# EAGLE design FanControllerv10 (EAGLE 6.4)
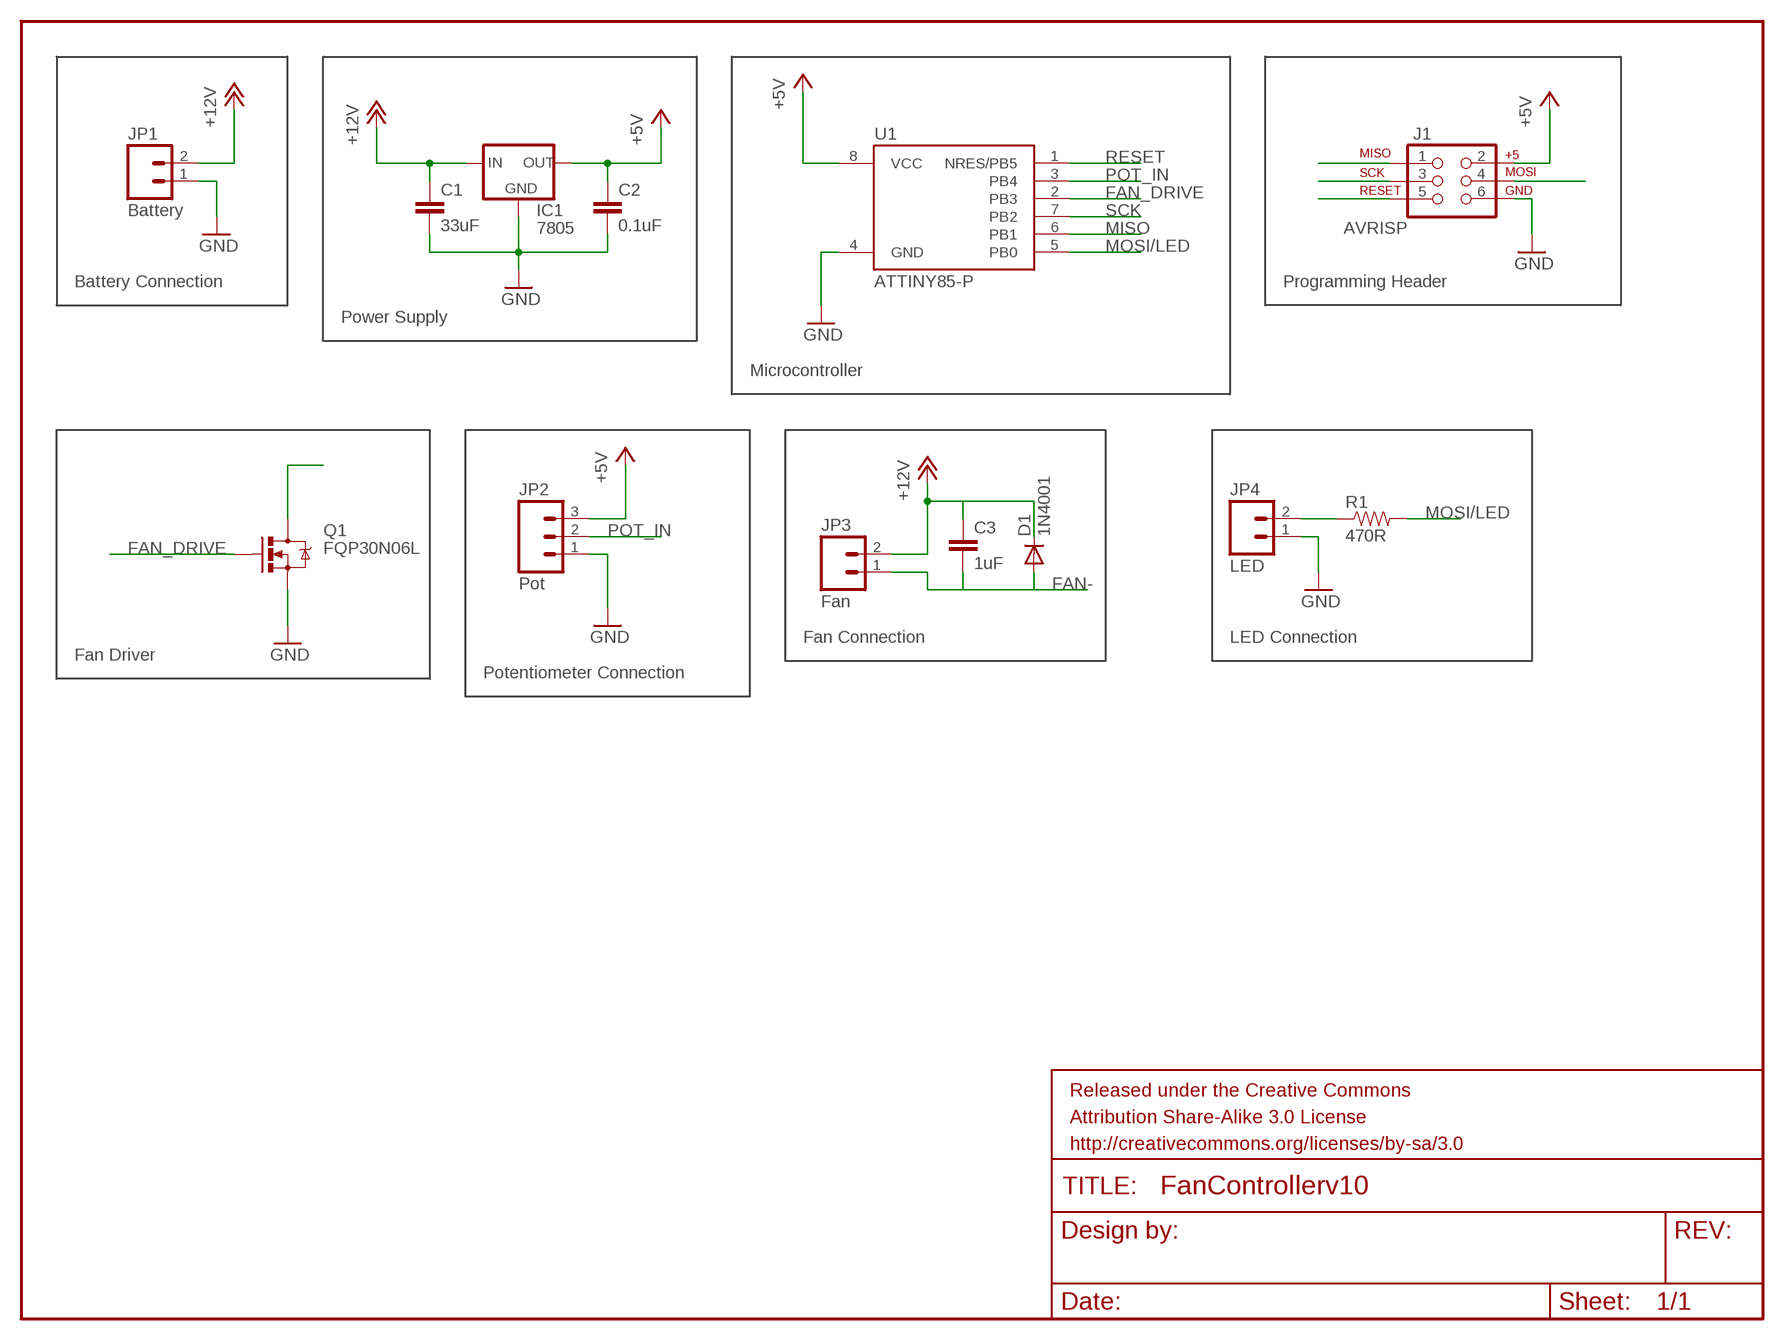
[diagram p0: schematic, sheet 1]

## Parts
C1  33uF  CAPPTH  [CAP-PTH-SMALL]
C2  0.1uF  CAPPTH  [CAP-PTH-SMALL]
C3  1uF  CAPPTH  [CAP-PTH-SMALL]
D1  1N4001  DIODE1N4148  [DIODE-1N4148]
FRAME1  FRAME-LETTER  [CREATIVE_COMMONS]
IC1  7805  V_REG_78XXSIDE  [78XXL]
J1  AVRISP  AVR_SPI_PRG_6PTH  [2X3]
JP1  Battery  M02PTH  [1X02]
JP2  Pot  M03PTH  [1X03]
JP3  Fan  M02PTH  [1X02]
JP4  LED  M02PTH  [1X02]
Q1  FQP30N06L  MOSFET-NCHANNELFQP30N06L  [TO220V]
R1  470R  RESISTOR1206  [1206]
U1  ATTINY85-P  [PDIP08_300MIL]

## Nets
+5V: C2.1 IC1.OUT J1.2 JP2.3 U1.8(VCC)
+12V: C1.1 C3.1 D1.C IC1.IN JP1.2 JP3.2
FAN-: C3.2 D1.A JP3.1 Q1.2(D)
FAN_DRIVE: Q1.1(G) U1.2(PB3)
GND: C1.2 C2.2 IC1.GND J1.6 JP1.1 JP2.1 JP4.1 Q1.3(S) U1.4(GND)
MISO: J1.1 U1.6(PB1)
MOSI/LED: J1.4 R1.2 U1.5(PB0)
N$1: JP4.2 R1.1
POT_IN: JP2.2 U1.3(PB4)
RESET: J1.5 U1.1(NRES/PB5)
SCK: J1.3 U1.7(PB2)

## Notes on the sheet
- Battery Connection | Programming Header
- Power Supply
- Microcontroller
- Fan Connection | LED Connection
- Fan Driver
- Potentiometer Connection

## Library data of the parts
C1-C3 = SparkFun-Capacitors:CAP: Capacitor Standard 0603 ceramic capacitor, and 0.1" leaded capacitor.
D1 = SparkFun-DiscreteSemi:DIODE: Diode These are standard reverse protection diodes and small signal diodes. SMA package can handle up to about 1A. SOD-323 can handle about 200mA. What the SOD-323 package when ordering, there are some mfgs out there that are 5-pin packages.
FRAME1 = SparkFun-Aesthetics:FRAME-LETTER: Schematic Frame Standard 8.5x11 US Letter frame
IC1 = SparkFun-PowerIC:V_REG_78XX: Voltage Regulator Standard 7805 5V regulator. IGO (Input Ground Output). Spark Fun Electronics SKU : COM-00107
J1 = SparkFun-Connectors:AVR_SPI_PRG_6: AVR ISP 6 Pin This is the reduced ISP connector for AVR programming. Common on Arduino. This footprint will take up less PCB space and can be used with a 10-pin to 6-pin adapter such as SKU: BOB-08508
JP1 JP3 JP4 = SparkFun-Connectors:M02: Header 2 Standard 2-pin 0.1" header. Use with straight break away headers (SKU : PRT-00116), right angle break away headers (PRT-00553), swiss pins (PRT-00743), machine pins (PRT-00117), and female headers (PRT-00115). Molex polarized connector foot print use with SKU : PRT-08233 with associated crimp pins and housings.
JP2 = SparkFun-Connectors:M03: Header 3 Standard 3-pin 0.1" header. Use with straight break away headers (SKU : PRT-00116), right angle break away headers (PRT-00553), swiss pins (PRT-00743), machine pins (PRT-00117), and female headers (PRT-00115). Molex polarized connector foot print use with SKU : PRT-08232 with associated crimp pins and housings.
Q1 = SparkFun-DiscreteSemi:MOSFET-NCHANNEL: Common NMOSFET Parts MFG P/N Store ID Prod ID FDD8780 TRANS-09984 SI7820DN TRANS-11055 FDS6630A IC-08089 2N7002PW TRANS-11151 FQP30N06L COM-10213 TRANS-10060 BSS123LT1G TRANS-08345 BSS138 TRANS-00830 BS170 2N7000; PROD_ID: TRANS-10060
R1 = SparkFun-Resistors:RESISTOR: Resistor Basic schematic elements and footprints for 0603, 1206, and PTH resistors.
U1 = _hhn_attiny25_45_85:ATTINY85*: ATMEL ATtiny 85 Packages: P = PDIP 08 30mil S = SOIC 08 EIAJ 208mil Technologies Note: for complete ordering code (temp. range, finish, tape&reel etc.) see www.atmel.com • Supply Voltage: V = (1.8…5.5)V | [blank] = (2.7…5.5)V • Speed: 10 = 10 MHz | 20 = 20 MHz Author: Dipl.-Ing. FH Rainer Bayer HHN Hochschule Heilbronn (Heilbronn University), rainer.bayer@hs-heilbronn.de Ingenieurbüro ing-rb, mail@ing-rb.de

## Board
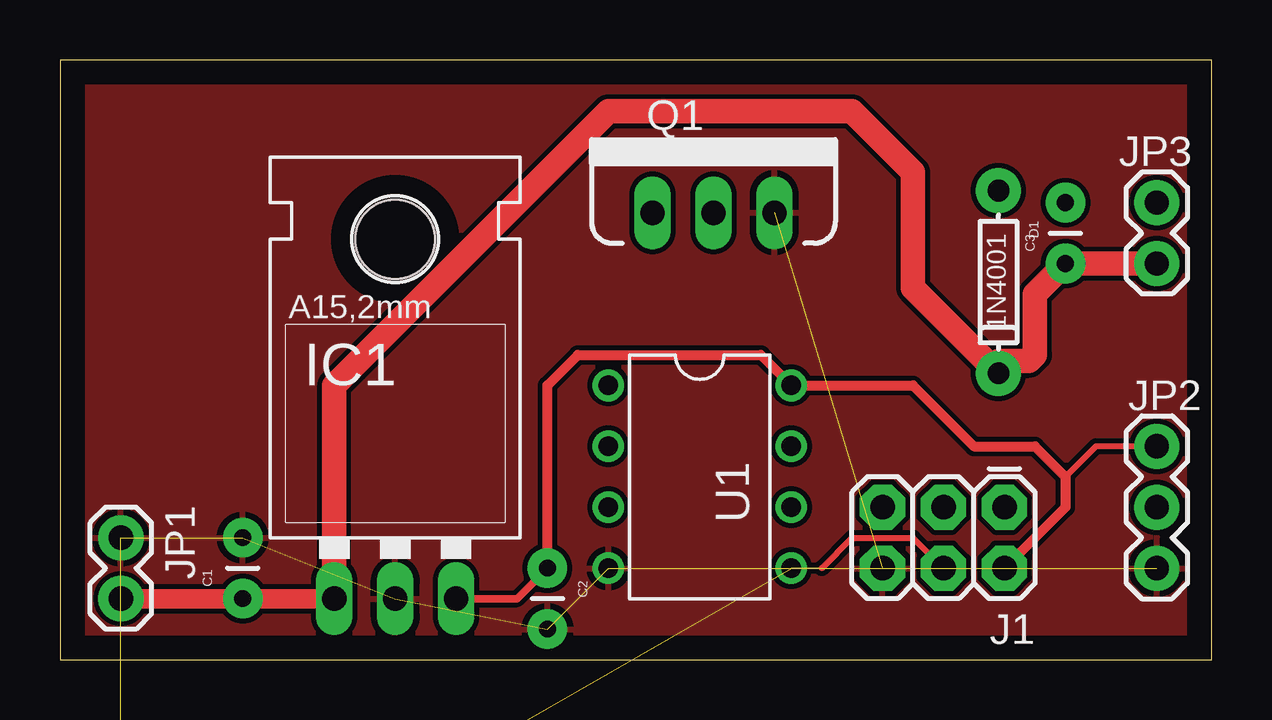
[diagram p1: board, top side]
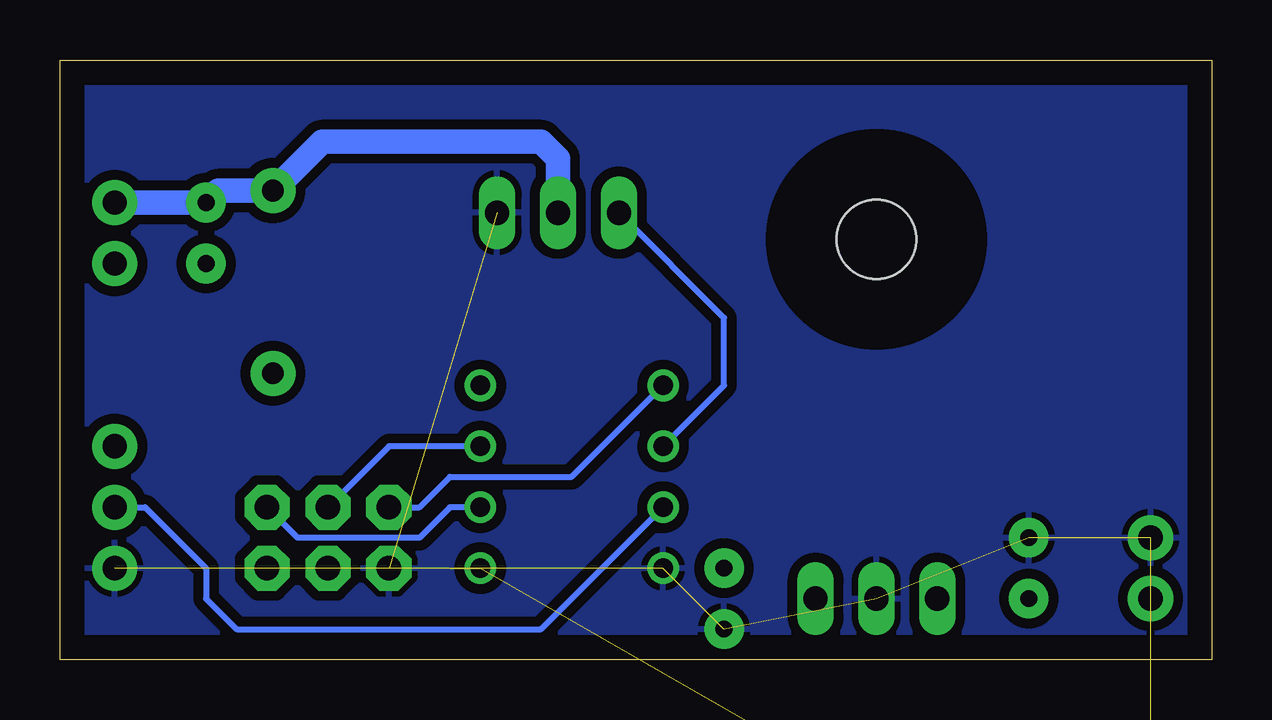
[diagram p2: board, bottom side, seen from below]

Size 48 x 25 mm. Coordinates in mm from the lower left corner, seen from the top.
Outline: 0,0 48,0 48,25 0,25 0,0
Copper layers (1*16): Top 0.035mm / dielectric 1.5mm / Bottom 0.035mm
Design rules "default": minimum track width 10mil, minimum drill 24mil, track to track 8mil, track to pad 8mil, pad to pad 8mil, via to via 8mil, smd to smd 8mil, copper to edge 40mil, drill to drill 8mil, minimum pad ring 10mil, minimum via ring 8mil, stop-mask expansion 4mil, vias tented up to drill 0mil, thermal gap 10mil

### Footprints (pad centres in the part's own frame; a part is rotated, then mirrored left to right if it is on the bottom)
CAP-PTH-SMALL = drill 0.7 pad 1.651: 1 0,0; 2 2.54,0
DIODE-1N4148 = drill 0.9 pad 1.88: A -3.81,0; C 3.81,0
78XXL = drill 1.016 long: GND 0,-3.81; IN -2.54,-3.81; OUT 2.54,-3.81 | hole 3.302: 0,11.176
2X3 = drill 1.016 pad 1.88 octagon: 1 0,0; 2 0,2.54; 3 2.54,0; 4 2.54,2.54; 5 5.08,0; 6 5.08,2.54
1X02 = drill 1.016 pad 1.88: 1 0,0; 2 2.54,0
1X03 = drill 1.016 pad 1.88: 1 0,0; 2 2.54,0; 3 5.08,0
TO220V = drill 1.016 long: 1 -2.54,0; 2 0,0; 3 2.54,0
1206 = smd 1.6 x 1.8: 1 -1.4,0; 2 1.4,0
PDIP08_300MIL = drill 0.813: 1 -3.81,-3.81; 2 -1.27,-3.81; 3 1.27,-3.81; 4 3.81,-3.81; 5 3.81,3.81; 6 1.27,3.81; 7 -1.27,3.81; 8 -3.81,3.81

### Placement (x,y rotation side)
C1  7.62,2.54 90 top
C2  20.32,3.81 270 top
C3  41.91,16.51 90 top
D1  39.12,15.74 270 top
FRAME1  21,-8 0 top  (outside the outline)
IC1  13.97,6.35 0 top
J1  39.37,6.35 180 top
JP1  2.54,5.08 270 top
JP2  45.72,3.81 90 top
JP3  45.72,19.05 270 top
JP4  2.54,-17.78 0 top  (outside the outline)
Q1  27.24,18.63 0 top
R1  2.54,-11.43 0 top  (outside the outline)
U1  26.67,7.62 270 top

### Tracks (layer width: path | path; a pad name or v marks a point on that pad's centre or on a via)
+5V
  Top 0.254: JP2.3 43.18,8.89 41.91,7.62
  Top 0.305: IC1.OUT 19.05,2.54 C2.1
  Top 0.406: C2.1 20.32,11.43 21.59,12.7 29.21,12.7 U1.8 35.56,11.43 38.1,8.89 40.64,8.89 41.91,7.62 41.91,6.35 J1.2
+12V
  Top 0.813: JP1.2 C1.1 IC1.IN
  Top 1.016: IC1.IN 11.43,11.43 22.86,22.86 33.02,22.86 35.56,20.32 35.56,15.49 D1.C 39.12,12.45 40.39,12.45 40.64,12.7 40.64,15.24 C3.1 JP3.2
FAN-
  Bottom 1.016: Q1.2 27.24,20.89 27.94,21.59 37.08,21.59 D1.A 41.41,19.55 C3.2 JP3.1
FAN_DRIVE
  Bottom 0.254: U1.2 20.32,11.43 20.32,14.25 Q1.1
GND  (8 unrouted)
  pour Bottom (isolate 0.406): 0,25 48,25 48,0 0,0
  pour Top (isolate 0.16): 0,25 48,25 48,0 0,0
MISO
  Bottom 0.254: U1.6 31.75,6.35 33.02,5.08 38.1,5.08 J1.1
MOSI/LED  (2 unrouted)
  Top 0.254: 31.75,3.81 33.02,5.08 35.56,5.08 J1.4
N$1  (1 unrouted)
POT_IN
  Bottom 0.254: JP2.2 44.45,6.35 41.91,3.81 41.91,2.54 40.64,1.27 27.94,1.27 U1.3
RESET
  Bottom 0.254: J1.5 33.02,6.35 31.75,7.62 26.67,7.62 U1.1
SCK
  Bottom 0.254: U1.7 34.29,8.89 J1.3